# Altium schematic sheet X7A15T-Prog.SchDoc: PCB-Tester X7A15T-Prog
size A4; Address1: Hans-Bunte-Strasse 19; Address2: D-79108 Freiburg; Address3: Germany; DocumentNumber: U33110; SheetNumber: 12; SheetTotal: 20; Date: JUN 2020; CheckedBy: Moerz, Hoeren; Author: Rudziński; CompanyName: TDK-Micronas GmbH; DrawnBy: Rudziński; Engineer: Rudziński; DateDraw: JUN 2020; DateChecked: 2020-06-19; PageSetup: Record=PageOptions|CenterHorizontal=True|CenterVertical=True|PrintScale=0.97|XCorrection=1.00|YCorrection=1.00|PrintKind=0|BorderSize=5000000|LeftOffset=0|BottomOffset=0|Orientation=2|PaperLength=1000|PaperWidth=1000|Scale=100|PaperSource=7|PrintQuality=-3|MediaType=1|DitherType=10|PrintScaleMode=1|PaperKind=A4|PaperIndex=9; TitleTyp: Title-Typ; Block: CPU & SCT8; Workspace: Workspace
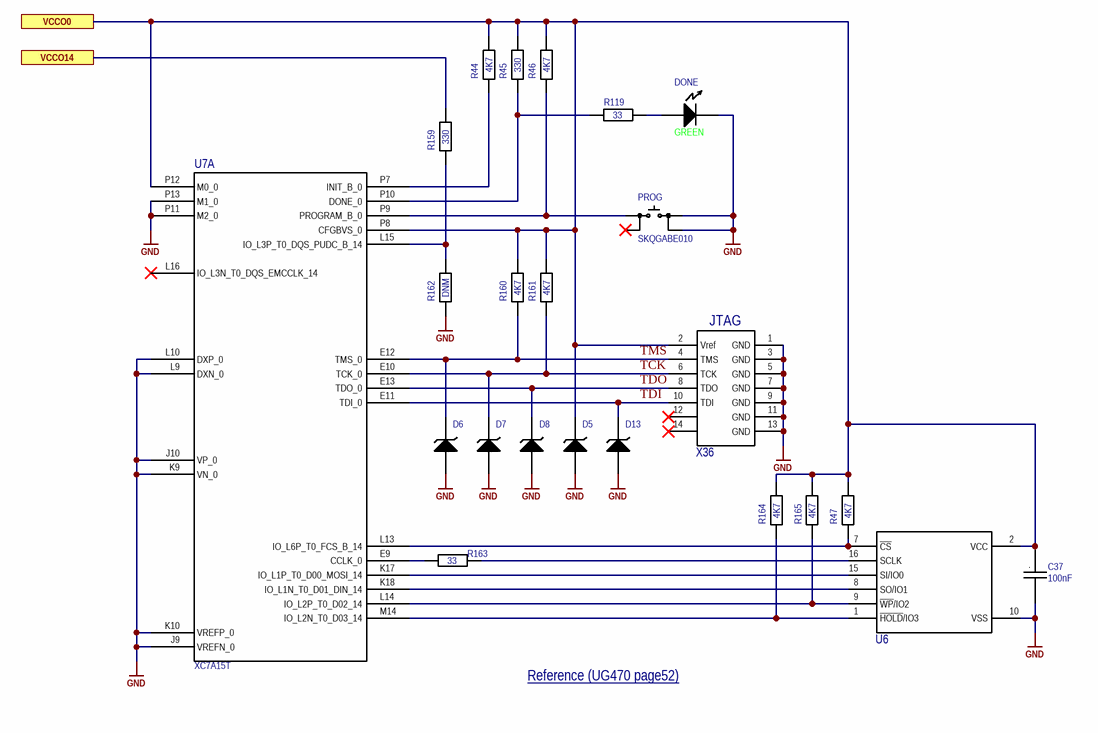
[diagram p0: X7A15T-Prog.SchDoc]

## Parts
C37  value 100nF  [C0402 Reflow]  (hidden comment: C)
D5  D  [SOD323]  (value not drawn)
D6  D  [SOD323]  (value not drawn)
D7  D  [SOD323]  (value not drawn)
D8  D  [SOD323]  (value not drawn)
D13  D  [SOD323]  (value not drawn)
DONE  Color: GREEN  [L0603G]  (hidden comment: D)
PROG  SKQGABE010  [SKQGABE010]
R44  value 4K7  [R0402 Reflow]  (hidden comment: R)
R45  value 330  [R0402 Reflow]  (hidden comment: R)
R46  value 4K7  [R0402 Reflow]  (hidden comment: R)
R47  value 4K7  [R0402 Reflow]  (hidden comment: R)
R119  value 33  [R0402 Reflow]  (hidden comment: R)
R159  value 330  [R0402 Reflow]  (hidden comment: R)
R160  value 4K7  [R0402 Reflow]  (hidden comment: R)
R161  value 4K7  [R0402 Reflow]  (hidden comment: R)
R162  value DNM  [R0402 Reflow]  (hidden comment: R)  (no BOM)
R163  value 33  [R0402 Reflow]  (hidden comment: R)
R164  value 4K7  [R0402 Reflow]  (hidden comment: R)
R165  value 4K7  [R0402 Reflow]  (hidden comment: R)
U6  U  [SOICW-16]  (value not drawn)
U7  NicName: XC7A15T  [XC7A15T-1CSG324C]  (hidden comment: U)  (part A of 8)
X36  NickName: JTAG  [LTMM-107-02-F-D]  (hidden comment: X)

## Ports
VCCO0, VCCO14

## Nets
GND: C37.2 D5.1(A) D6.1(A) D7.1(A) D8.1(A) D13.1(A) DONE.2(Cathode) PROG.3 PROG.4 R162.1 U6.10(VSS) U7.J9(VREFN_0) U7.J10(VP_0) U7.K9(VN_0) U7.K10(VREFP_0) U7.L9(DXN_0) U7.L10(DXP_0) U7.P11(M2_0) U7.P13(M1_0) X36.1(GND) X36.3(GND) X36.5(GND) X36.7(GND) X36.9(GND) X36.11(GND) X36.13(GND)
TCK: D7.2(C) R161.1 U7.E10(TCK_0) X36.6(TCK)
TDI: D13.2(C) U7.E11(TDI_0) X36.10(TDI)
TDO: D8.2(C) U7.E13(TDO_0) X36.8(TDO)
TMS: D6.2(C) R160.1 U7.E12(TMS_0) X36.4(TMS)
VCCO0: C37.1 D5.2(C) R44.2 R45.2 R46.2 R47.2 R160.2 R161.2 R164.2 R165.2 U6.2(VCC) U7.P8(CFGBVS_0) U7.P12(M0_0) X36.2(Vref) ; port VCCO0
VCCO14: R159.2 ; port VCCO14
NetDONE_1: DONE.1(Anode) R119.2
NetPROG_1: PROG.1 R46.1 U7.P9(PROGRAM_B_0)
NetR44_1: R44.1 U7.P7(INIT_B_0)
NetR45_1: R45.1 R119.1 U7.P10(DONE_0)
NetR47_1: R47.1 U6.7(~{CS}) U7.L13(IO_L6P_T0_FCS_B_14)
NetR159_1: R159.1 R162.2 U7.L15(IO_L3P_T0_DQS_PUDC_B_14)
NetR163_1: R163.1 U7.E9(CCLK_0)
NetR163_2: R163.2 U6.16(SCLK)
NetR164_1: R164.1 U6.1(~{HOLD}/IO3) U7.M14(IO_L2N_T0_D03_14)
NetR165_1: R165.1 U6.9(~{WP}/IO2) U7.L14(IO_L2P_T0_D02_14)
NetU6_8: U6.8(SO/IO1) U7.K18(IO_L1N_T0_D01_DIN_14)
NetU6_15: U6.15(SI/IO0) U7.K17(IO_L1P_T0_D00_MOSI_14)

Not connected (* = marked no-connect by the designer): PROG 2*; U7 L16(IO_L3N_T0_DQS_EMCCLK_14)*; X36 12* 14*

## Notes on the sheet
- Reference (UG470 page52) <https://www.xilinx.com/support/documentation/user_guides/ug470_7Series_Config.pdf>
- designed by
- reviewed by
- last drawn by
- Project:
- Schematic:
- last printed
- DIN-A4 L
- sheets
- of
- File:
- (in symbol C) .

## Library data of the parts
C37 = C: CAP CER 0.1UF 25V X7R 0402; 04. Manufacturer: Yageo; 07. Manufacturer  Part Number: CC0402KRX7R8BB104; Tolerance: ±5%; Voltage Rating: 16V; 03. Unit Price: 0.09; 13. Created Date/Name: AUG2018/Hören; Type: X7R; ComponentLink1Description: Info; ComponentLink1URL: https://www.digikey.de/product-detail/en/kemet/C0402C104J4RACTU/399-7761-6-ND/3472292; 02. Distributor Part Number: 311-2077-6-ND; 09. Operating Temperature: -55°C ~ 125°C; 11. RoHS: YES; 01. Distributor: DigiKey; ComponentLink2Description: DataSheet; ComponentLink2URL: https://content.kemet.com/datasheets/KEM_C1002_X7R_SMD.pdf; Package: 0402
D5-D8 D13 = UCLAMP3301D.TCT: TVS DIODE 3.3V 9.5V SOD323; 04. Manufacturer: Semtech Corporation; 03. Unit Price: 0.67; 01. Distributor: DigiKey; 02. Distributor Part Number: UCLAMP3301DCT-ND; 07. Manufacturer  Part Number: UCLAMP3301D.TCT; 11. RoHS: YES; ComponentLink1Description: Info; ComponentLink1URL: https://www.digikey.de/product-detail/en/nexperia-usa-inc/PMEG4050EP115/1727-5842-6-ND/2697559; ComponentLink2Description: DataSheet; ComponentLink2URL: https://assets.nexperia.com/documents/data-sheet/PMEG4050EP.pdf
DONE = LED: LED GREEN DIFFUSED 0603 SMD; 04. Manufacturer: OSRAM Opto Semiconductors Inc.; 07. Manufacturer  Part Number: LG L29K-G2J1-24-Z; Vf: 1.7V; If: 2mA; Wave Length: 570nm; Viewing Angle: 160°; 03. Unit Price: 0.4; 13. Created Date/Name: AUG2018/Hören; ComponentLink1Description: Info; ComponentLink1URL: https://www.digikey.de/products/en?keywords=475-2709-6-ND; ComponentLink2Description: DataSheet; ComponentLink2URL: https://www.digikey.de/products/en?keywords=475-2709-6-ND; 02. Distributor Part Number: 475-2709-6-ND; 11. RoHS: YES; 01. Distributor: DigiKey
PROG = PUSH_BTN: Tactile Switches 5.2x5.2x1.5mm 160gf; 04. Manufacturer: Alps; 03. Unit Price: 0.497; ComponentLink1URL: *; ComponentLink1Description: Info; 02. Distributor Part Number: 688-SKQGAB; 07. Manufacturer  Part Number: SKQGABE010; 11. RoHS: YES; 01. Distributor: Mouser; ComponentLink2Description: DataSheet; Value: SKQGABE010
R44 R46 R47 R160 R161 R164 R165 = R: RES SMD 4.7K OHM 1% 1/16W 0402; 04. Manufacturer: Yageo; 07. Manufacturer  Part Number: RC0402FR-074K7L; 03. Unit Price: 0.09; 13. Created Date/Name: AUG2018/Hören; Power Rating: 63mW; Tolerance: ±1%; ComponentLink1URL: https://www.digikey.de/products/en?keywords=311-4.7KLRDKR-ND; ComponentLink1Description: Info; 02. Distributor Part Number: 311-4.7KLRDKR-ND; 09. Operating Temperature: -55°C ~ 155°C; 11. RoHS: YES; 01. Distributor: DigiKey; ComponentLink2Description: DataSheet; Type: Thick Film; Package: 0402
R45 R159 R162 = R: RES SMD 330 OHM 1% 1/16W 0402; 04. Manufacturer: Yageo; 07. Manufacturer  Part Number: RC0402FR-07330RL; 03. Unit Price: 0.09; 13. Created Date/Name: AUG2018/Hören; Power Rating: 63mW; Tolerance: ±1%; ComponentLink1URL: https://www.digikey.de/products/en?keywords=311-330LRDKR-ND; ComponentLink1Description: Info; 02. Distributor Part Number: 311-330LRDKR-ND; 09. Operating Temperature: -55°C ~ 155°C; 11. RoHS: YES; 01. Distributor: DigiKey; ComponentLink2Description: DataSheet; Type: Thick Film; Package: 0402
R119 R163 = R_19: RES SMD 33 OHM 1% 1/16W 0402; 04. Manufacturer: Yageo; 07. Manufacturer  Part Number: RC0402FR-0733RL; 03. Unit Price: 0.09; 13. Created Date/Name: AUG2018/Hören; Power Rating: 63mW; Tolerance: ±1%; ComponentLink1URL: https://www.digikey.de/products/en?keywords=311-33.0LRDKR-ND; ComponentLink1Description: Info; 02. Distributor Part Number: 311-33.0LRDKR-ND; 09. Operating Temperature: -55°C ~ 155°C; 11. RoHS: YES; 01. Distributor: DigiKey; ComponentLink2Description: DataSheet; Type: Thick Film; Package: 0402
U6 = S25FL128SAGMFI000: IC FLASH 128M SPI 133MHZ 16SOIC; 04. Manufacturer: Cypress Semiconductor Corp; 03. Unit Price: 2.77; 01. Distributor: Digikey; 02. Distributor Part Number: 1274-1000-ND; 07. Manufacturer  Part Number: S25FL128SAGMFI000; ComponentLink2Description: DataSheet; NickName: S25FL128SAGMFI000
U7 = XC7A15T-CS324: XC7A15T-1CSG324C; MFR: XILINX; POPULATED: yes; 03. Unit Price: 20.65; MFR-PN: XC7A15T-CS324; 04. Manufacturer: XILINX; 07. Manufacturer  Part Number: XC7A15T-1CSG324C; 01. Distributor: Avnet; 02. Distributor Part Number: XC7A15T-1CSG324C; 09. Operating Temperature: 0°C ~ 85°C (TJ); 11. RoHS: YES; ComponentLink4Description: Info; ComponentLink4URL: https://www.digikey.de/products/en?keywords=XC7A15T-1CSG324C; ComponentLink5Description: DataSheet; ComponentLink5URL: https://www.xilinx.com/support/documentation/data_sheets/ds181_Artix_7_Data_Sheet.pdf; ComponentLink6Description: NXP; ComponentLink6URL: https://www.nxp.com/part/MK20DN512VMD10
X36 = LTMM-107-02-F-D: CONN HEADER VERT 14POS 2MM; 04. Manufacturer: Samtec Inc.; 03. Unit Price: 2.38; 13. Created Date/Name: ??? / Hören; System: Connector; 01. Distributor: DigiKey; 02. Distributor Part Number: LTMM-107-02-F-D-ND; 07. Manufacturer  Part Number: LTMM-107-02-F-D; 11. RoHS: YES; ComponentLink1Description: Info; ComponentLink1URL: https://www.digikey.de/product-detail/en/samtec-inc/LTMM-107-02-F-D/LTMM-107-02-F-D-ND/8723899; ComponentLink2Description: DataSheet; ComponentLink2URL: https://www.samtec.com/products/ltmm